# EAGLE schematic MystiqueJamma (EAGLE 9.1.3)
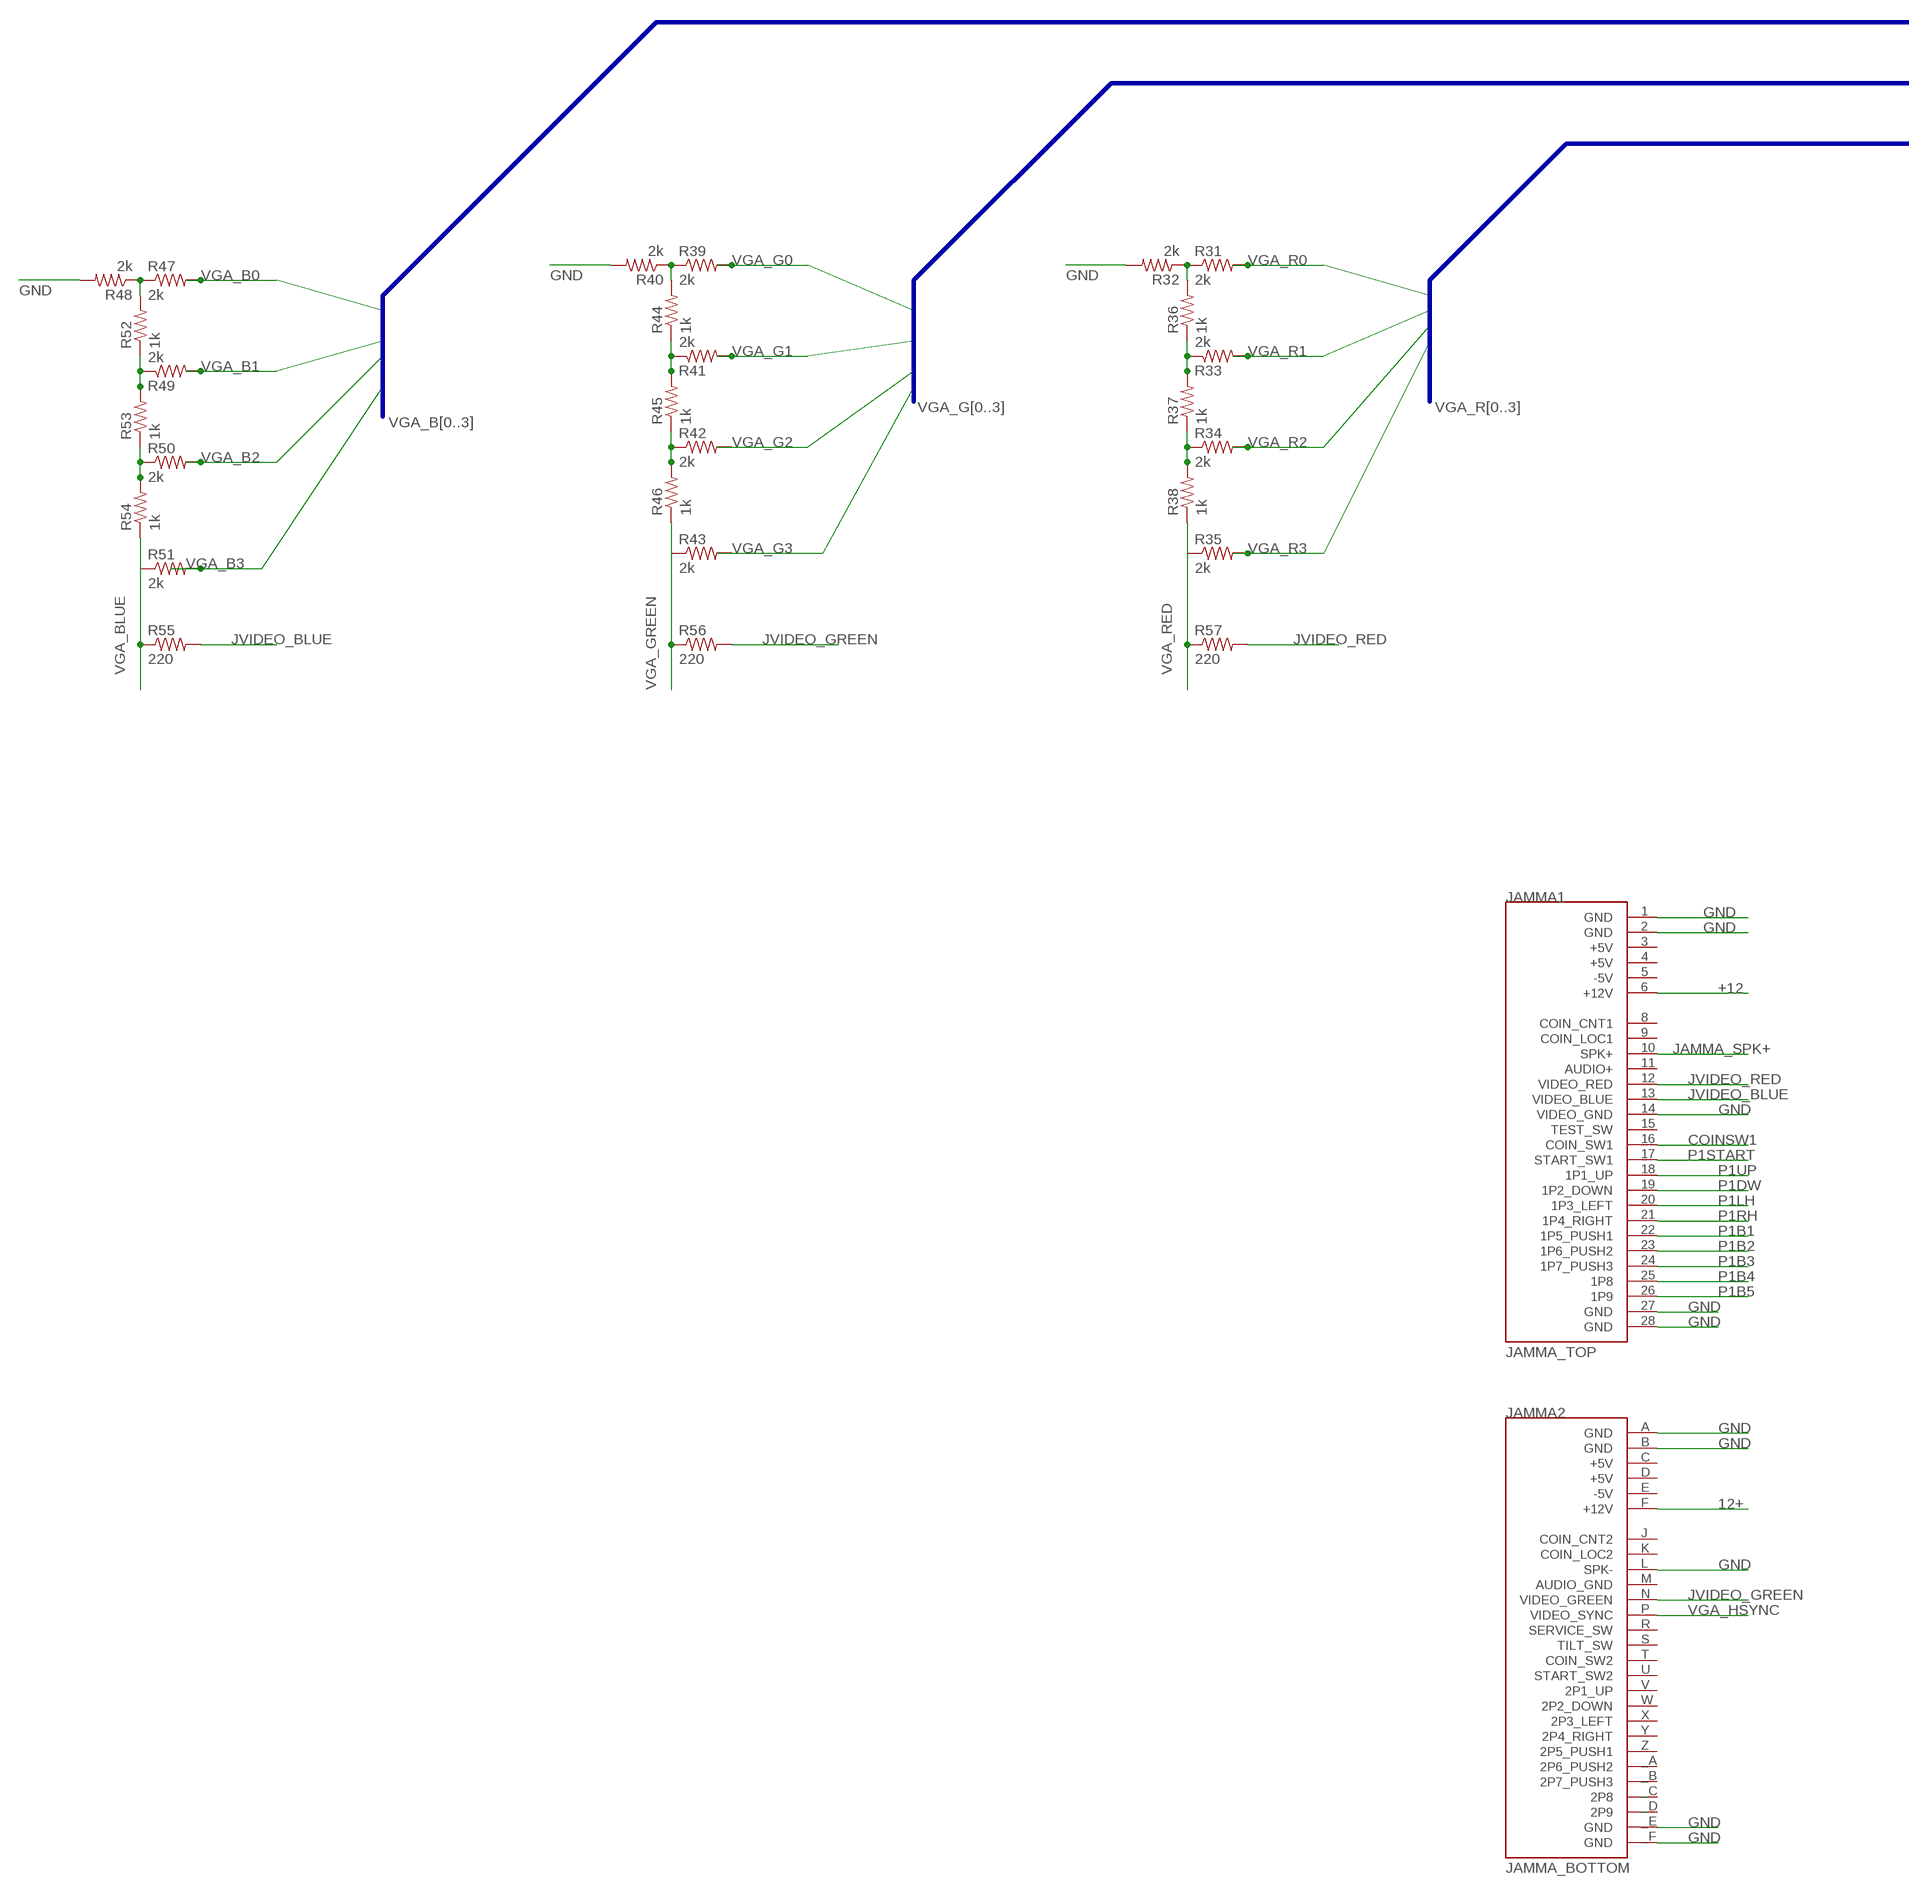
[diagram p0: schematic, sheet 1, part 1 of 2]
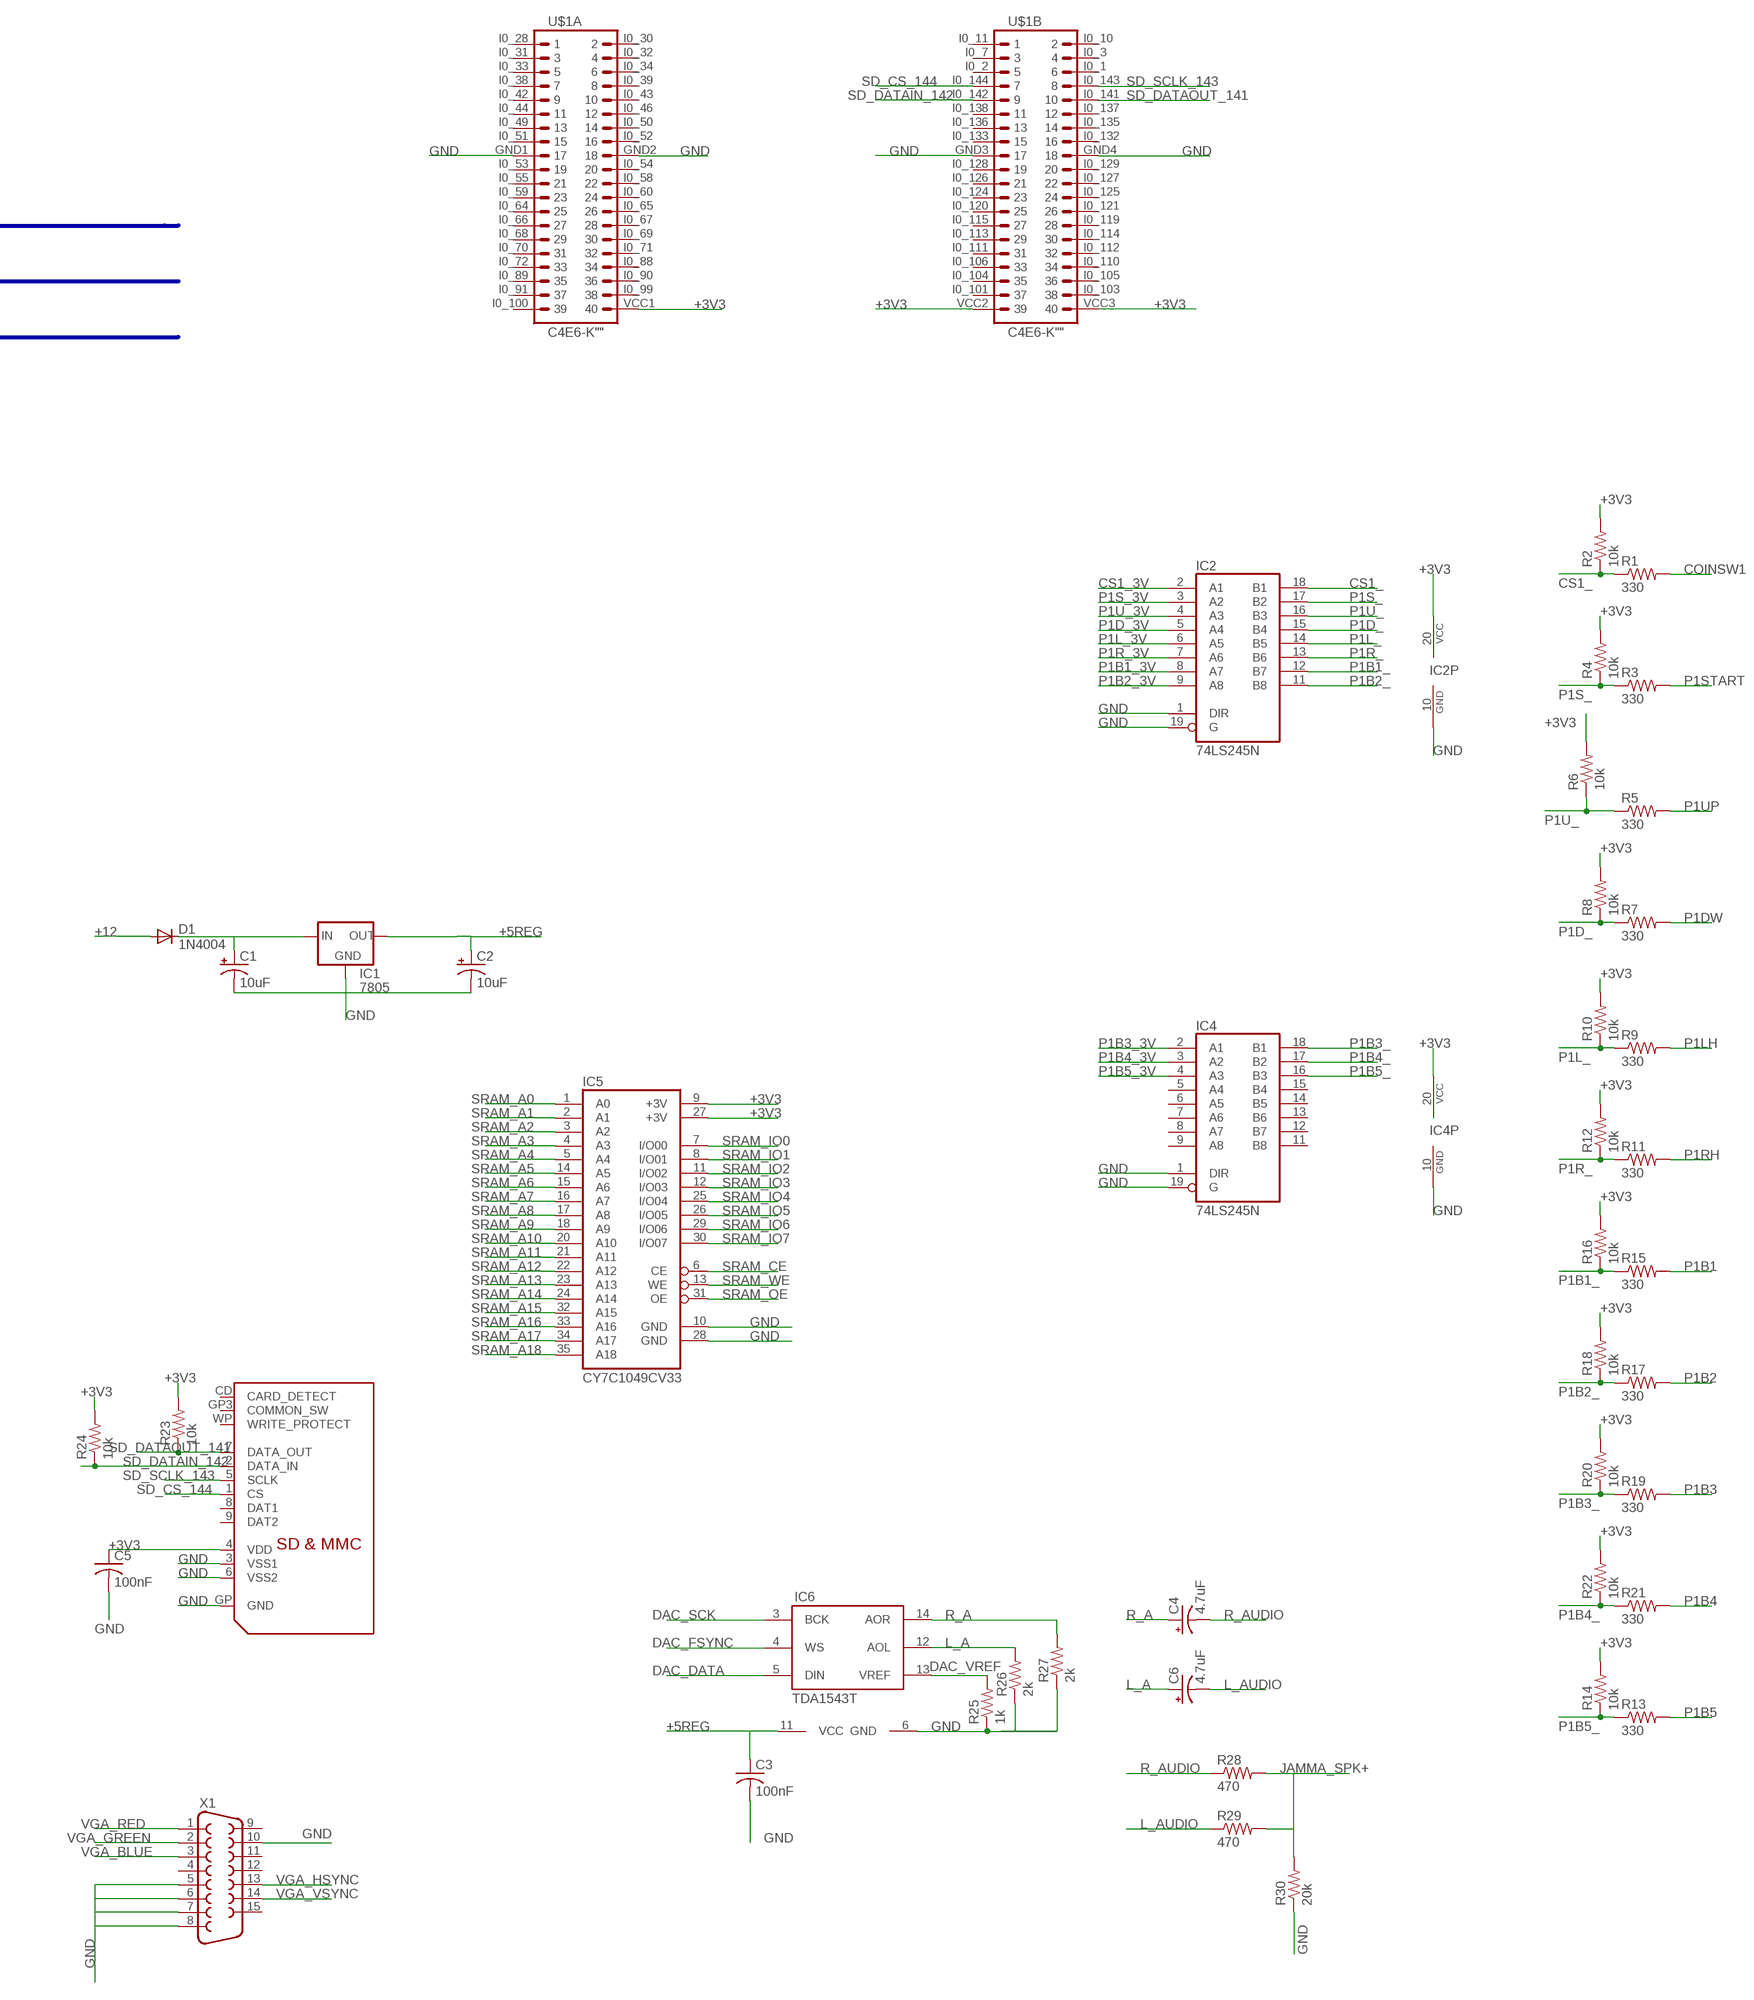
[diagram p1: schematic, sheet 1, part 2 of 2]

## Parts
C1  10uF  CPOL-USE2.5-5  [E2,5-5]
C2  10uF  CPOL-USE2.5-5  [E2,5-5]
C3  100nF  C-US025-025X050  [C025-025X050]
C4  4.7uF  CPOL-USE5-6  [E5-6]
C5  100nF  C-US025-024X044  [C025-024X044]
C6  4.7uF  CPOL-USE5-6  [E5-6]
D1  1N4004  [DO41-10]
IC1  7805  V_REG_78XXSINK  [TO220-IGO]
IC2  74LS245N  [DIL20]
IC4  74LS245N  [DIL20]
IC5  CY7C1049CV33  [SOJV36-400]
IC6  TDA1543T  [SOIC-16NW]
JAMMA1  JAMMA_TOP  [JAMMA_TOP]
JAMMA2  JAMMA_BOTTOM  [JAMMA_BOTTOM]
R1  330  R-US_0207/7  [0207/7]
R2  10k  R-US_0207/7  [0207/7]
R3  330  R-US_0207/7  [0207/7]
R4  10k  R-US_0207/7  [0207/7]
R5  330  R-US_0207/7  [0207/7]
R6  10k  R-US_0207/7  [0207/7]
R7  330  R-US_0207/7  [0207/7]
R8  10k  R-US_0207/7  [0207/7]
R9  330  R-US_0207/7  [0207/7]
R10  10k  R-US_0207/7  [0207/7]
R11  330  R-US_0207/7  [0207/7]
R12  10k  R-US_0207/7  [0207/7]
R13  330  R-US_0207/7  [0207/7]
R14  10k  R-US_0207/7  [0207/7]
R15  330  R-US_0207/7  [0207/7]
R16  10k  R-US_0207/7  [0207/7]
R17  330  R-US_0207/7  [0207/7]
R18  10k  R-US_0207/7  [0207/7]
R19  330  R-US_0207/7  [0207/7]
R20  10k  R-US_0207/7  [0207/7]
R21  330  R-US_0207/7  [0207/7]
R22  10k  R-US_0207/7  [0207/7]
R23  10k  R-US_0207/7  [0207/7]
R24  10k  R-US_0207/7  [0207/7]
R25  1k  R-US_0207/7  [0207/7]
R26  2k  R-US_0207/7  [0207/7]
R27  2k  R-US_0207/7  [0207/7]
R28  470  R-US_0207/7  [0207/7]
R29  470  R-US_0207/7  [0207/7]
R30  20k  R-US_0207/7  [0207/7]
R31  2k  R-US_0207/7  [0207/7]
R32  2k  R-US_0207/7  [0207/7]
R33  2k  R-US_0207/7  [0207/7]
R34  2k  R-US_0207/7  [0207/7]
R35  2k  R-US_0207/7  [0207/7]
R36  1k  R-US_0207/7  [0207/7]
R37  1k  R-US_0207/7  [0207/7]
R38  1k  R-US_0207/7  [0207/7]
R39  2k  R-US_0207/7  [0207/7]
R40  2k  R-US_0207/7  [0207/7]
R41  2k  R-US_0207/7  [0207/7]
R42  2k  R-US_0207/7  [0207/7]
R43  2k  R-US_0207/7  [0207/7]
R44  1k  R-US_0207/7  [0207/7]
R45  1k  R-US_0207/7  [0207/7]
R46  1k  R-US_0207/7  [0207/7]
R47  2k  R-US_0207/7  [0207/7]
R48  2k  R-US_0207/7  [0207/7]
R49  2k  R-US_0207/7  [0207/7]
R50  2k  R-US_0207/7  [0207/7]
R51  2k  R-US_0207/7  [0207/7]
R52  1k  R-US_0207/7  [0207/7]
R53  1k  R-US_0207/7  [0207/7]
R54  1k  R-US_0207/7  [0207/7]
R55  220  R-US_0207/7  [0207/7]
R56  220  R-US_0207/7  [0207/7]
R57  220  R-US_0207/7  [0207/7]
U$1  C4E6-K""  [E6V33]
U$2  SDMMC06132  [06132]
X1  F15HDH  [HDF15H]

## Nets
12+: JAMMA2.F(+12V)
+3V3: C5.1 IC2.20(VCC) IC4.20(VCC) IC5.9(+3V) IC5.27(+3V) R2.2 R4.2 R6.2 R8.2 R10.2 R12.2 R14.2 R16.2 R18.2 R20.2 R22.2 R23.2 R24.2 U$1.VCC1 U$1.VCC2 U$2.4(VDD)
+5REG: C2.+ C3.1 IC1.OUT IC6.11(VCC)
+12: D1.A JAMMA1.6(+12V)
COINSW1: JAMMA1.16(COIN_SW1) R1.2
CS1_: IC2.18(B1) R1.1 R2.1
CS1_3V: IC2.2(A1)
DAC_DATA: IC6.5(DIN)
DAC_FSYNC: IC6.4(WS)
DAC_SCK: IC6.3(BCK)
DAC_VREF: IC6.13(VREF) R25.2
GND: C1.- C2.- C3.2 C5.2 IC1.GND IC2.1(DIR) IC2.10(GND) IC2.19(G) IC4.1(DIR) IC4.10(GND) IC4.19(G) IC5.10(GND) IC5.28(GND) IC6.6(GND) JAMMA1.1(GND) JAMMA1.2(GND) JAMMA1.14(VIDEO_GND) JAMMA1.27(GND) JAMMA1.28(GND) JAMMA2._E(GND) JAMMA2._F(GND) JAMMA2.A(GND) JAMMA2.B(GND) JAMMA2.L(SPK-) R25.1 R26.1 R27.1 R30.1 R32.2 R40.2 R48.2 U$1.GND1 U$1.GND2 U$1.GND3 U$1.GND4 U$2.3(VSS1) U$2.6(VSS2) U$2.GP(GND) X1.5 X1.10
JAMMA_SPK+: JAMMA1.10(SPK+) R28.2 R29.2 R30.2
JVIDEO_BLUE: JAMMA1.13(VIDEO_BLUE) R55.2
JVIDEO_GREEN: JAMMA2.N(VIDEO_GREEN) R56.2
JVIDEO_RED: JAMMA1.12(VIDEO_RED) R57.2
L_A: C6.+ IC6.12(AOL) R26.2
L_AUDIO: C6.- R29.1
N$1: R31.1 R32.1 R36.2
N$2: C1.+ D1.C IC1.IN
N$3: R33.1 R36.1 R37.2
N$4: X1.8
N$5: X1.7
N$6: X1.6
N$7: R34.1 R37.1 R38.2
N$8: R39.1 R40.1 R44.2
N$9: R41.1 R44.1 R45.2
N$10: R42.1 R45.1 R46.2
N$11: R47.1 R48.1 R52.2
N$12: R49.1 R52.1 R53.2
N$13: R50.1 R53.1 R54.2
P1B1: JAMMA1.22(1P5_PUSH1) R15.2
P1B1_: IC2.12(B7) R15.1 R16.1
P1B1_3V: IC2.8(A7)
P1B2: JAMMA1.23(1P6_PUSH2) R17.2
P1B2_: IC2.11(B8) R17.1 R18.1
P1B2_3V: IC2.9(A8)
P1B3: JAMMA1.24(1P7_PUSH3) R19.2
P1B3_: IC4.18(B1) R19.1 R20.1
P1B3_3V: IC4.2(A1)
P1B4: JAMMA1.25(1P8) R21.2
P1B4_: IC4.17(B2) R21.1 R22.1
P1B4_3V: IC4.3(A2)
P1B5: JAMMA1.26(1P9) R13.2
P1B5_: IC4.16(B3) R13.1 R14.1
P1B5_3V: IC4.4(A3)
P1D_: IC2.15(B4) R7.1 R8.1
P1D_3V: IC2.5(A4)
P1DW: JAMMA1.19(1P2_DOWN) R7.2
P1L_: IC2.14(B5) R9.1 R10.1
P1L_3V: IC2.6(A5)
P1LH: JAMMA1.20(1P3_LEFT) R9.2
P1R_: IC2.13(B6) R11.1 R12.1
P1R_3V: IC2.7(A6)
P1RH: JAMMA1.21(1P4_RIGHT) R11.2
P1S_: IC2.17(B2) R3.1 R4.1
P1S_3V: IC2.3(A2)
P1START: JAMMA1.17(START_SW1) R3.2
P1U_: IC2.16(B3) R5.1 R6.1
P1U_3V: IC2.4(A3)
P1UP: JAMMA1.18(1P1_UP) R5.2
R_A: C4.+ IC6.14(AOR) R27.2
R_AUDIO: C4.- R28.1
SD_CS_144: U$1.I0_144 U$2.1(CS)
SD_DATAIN_142: R24.1 U$1.I0_142 U$2.2(DATA_IN)
SD_DATAOUT_141: R23.1 U$1.I0_141 U$2.7(DATA_OUT)
SD_SCLK_143: U$1.I0_143 U$2.5(SCLK)
SRAM_A0: IC5.1(A0)
SRAM_A1: IC5.2(A1)
SRAM_A2: IC5.3(A2)
SRAM_A3: IC5.4(A3)
SRAM_A4: IC5.5(A4)
SRAM_A5: IC5.14(A5)
SRAM_A6: IC5.15(A6)
SRAM_A7: IC5.16(A7)
SRAM_A8: IC5.17(A8)
SRAM_A9: IC5.18(A9)
SRAM_A10: IC5.20(A10)
SRAM_A11: IC5.21(A11)
SRAM_A12: IC5.22(A12)
SRAM_A13: IC5.23(A13)
SRAM_A14: IC5.24(A14)
SRAM_A15: IC5.32(A15)
SRAM_A16: IC5.33(A16)
SRAM_A17: IC5.34(A17)
SRAM_A18: IC5.35(A18)
SRAM_CE: IC5.6(CE)
SRAM_IO0: IC5.7(I/O00)
SRAM_IO1: IC5.8(I/O01)
SRAM_IO2: IC5.11(I/O02)
SRAM_IO3: IC5.12(I/O03)
SRAM_IO4: IC5.25(I/O04)
SRAM_IO5: IC5.26(I/O05)
SRAM_IO6: IC5.29(I/O06)
SRAM_IO7: IC5.30(I/O07)
SRAM_OE: IC5.31(OE)
SRAM_WE: IC5.13(WE)
VGA_B0: R47.2
VGA_B1: R49.2
VGA_B2: R50.2
VGA_B3: R51.2
VGA_BLUE: R51.1 R54.1 R55.1 X1.3
VGA_G0: R39.2
VGA_G1: R41.2
VGA_G2: R42.2
VGA_G3: R43.2
VGA_GREEN: R43.1 R46.1 R56.1 X1.2
VGA_HSYNC: JAMMA2.P(VIDEO_SYNC) X1.13
VGA_R0: R31.2
VGA_R1: R33.2
VGA_R2: R34.2
VGA_R3: R35.2
VGA_RED: R35.1 R38.1 R57.1 X1.1
VGA_VSYNC: X1.14
Unconnected: IC4.5(A4) IC4.6(A5) IC4.7(A6) IC4.8(A7) IC4.9(A8) IC4.11(B8) IC4.12(B7) IC4.13(B6) IC4.14(B5) IC4.15(B4) JAMMA1.8(COIN_CNT1) JAMMA1.9(COIN_LOC1) JAMMA1.11(AUDIO+) JAMMA1.15(TEST_SW) JAMMA2._A(2P6_PUSH2) JAMMA2._B(2P7_PUSH3) JAMMA2._C(2P8) JAMMA2._D(2P9) JAMMA2.J(COIN_CNT2) JAMMA2.K(COIN_LOC2) JAMMA2.M(AUDIO_GND) JAMMA2.R(SERVICE_SW) JAMMA2.S(TILT_SW) JAMMA2.T(COIN_SW2) JAMMA2.U(START_SW2) JAMMA2.V(2P1_UP) JAMMA2.W(2P2_DOWN) JAMMA2.X(2P3_LEFT) JAMMA2.Y(2P4_RIGHT) JAMMA2.Z(2P5_PUSH1) U$1.I0_1 U$1.I0_2 U$1.I0_3 U$1.I0_7 U$1.I0_10 U$1.I0_11 U$1.I0_28 U$1.I0_30 U$1.I0_31 U$1.I0_32 U$1.I0_33 U$1.I0_34 U$1.I0_38 U$1.I0_39 U$1.I0_42 U$1.I0_43 U$1.I0_44 U$1.I0_46 U$1.I0_49 U$1.I0_50 U$1.I0_51 U$1.I0_52 U$1.I0_53 U$1.I0_54 U$1.I0_55 U$1.I0_58 U$1.I0_59 U$1.I0_60 U$1.I0_64 U$1.I0_65 U$1.I0_66 U$1.I0_67 U$1.I0_68 U$1.I0_69 U$1.I0_70 U$1.I0_71 U$1.I0_72 U$1.I0_88 U$1.I0_89 U$1.I0_90 U$1.I0_91 U$1.I0_99 U$1.I0_100 U$1.I0_101 U$1.I0_103 U$1.I0_104 U$1.I0_105 U$1.I0_106 U$1.I0_110 U$1.I0_111 U$1.I0_112 U$1.I0_113 U$1.I0_114 U$1.I0_115 U$1.I0_119 U$1.I0_120 U$1.I0_121 U$1.I0_124 U$1.I0_125 U$1.I0_126 U$1.I0_127 U$1.I0_128 U$1.I0_129 U$1.I0_132 U$1.I0_133 U$1.I0_135 U$1.I0_136 U$1.I0_137 U$1.I0_138 U$1.VCC3 U$2.8(DAT1) U$2.9(DAT2) U$2.CD(CARD_DETECT) U$2.GP3(COMMON_SW) U$2.WP(WRITE_PROTECT) X1.4 X1.9 X1.11 X1.12 X1.15

## Buses
VGA_R[0..3]
VGA_G[0..3]
VGA_B[0..3]

## Power pins joined to a net without a drawn wire
+5V: JAMMA1.3(+5V) JAMMA1.4(+5V) JAMMA2.C(+5V) JAMMA2.D(+5V)
-5V: JAMMA1.5(-5V) JAMMA2.E(-5V)

## Library data of the parts
C1 C2 = rcl-2:CPOL-US: POLARIZED CAPACITOR, American symbol
C3 C5 = adafruit:C-US: CAPACITOR, American symbol
C4 C6 = adafruit:CPOL-US: POLARIZED CAPACITOR, American symbol
D1 = adafruit:1N4004: DIODE General purpose 1N400x type rectifier (With bigger pads) http://www.ladyada.net/library/pcb/eaglelibrary.html
IC1 = SparkFun:V_REG_78XX: Voltage Regulator Standard 7805 5V regulator. IGO (Input Ground Output). Spark Fun Electronics SKU : COM-00107
IC2 IC4 = 74xx-us:74*245: Octal BUS TRANSCEIVER, 3-state
IC5 = memory-sram:CY7C1049CV33: 4-Mbit (512K x 8) Static RAM Source: CYPRESS cy7c1049cv33_8.pdf
IC6 = TDA1543:TDA1543: TDA1543 I2S DAC
JAMMA1 = JAMMA:JAMMA_TOP: JAMMA Connector Top Parts side for these card-edge connenctors HIROSE CR7E-56DA-3.96E HIROSE CR7E-56DB-3.96E KEL 1168-056-009
JAMMA2 = JAMMA:JAMMA_BOTTOM: JAMMA Connector Bottom Solder side for these card-edge connenctors HIROSE CR7E-56DA-3.96E HIROSE CR7E-56DB-3.96E KEL 1168-056-009
R1-R57 = adafruit:R-US_: RESISTOR, American symbol
U$1 = FPGA-BOARD:C4E6-K: FPGA board size C4E6 - Cyclone IV
U$2 = adafruit:SDMMC: SD MMC Card holder 4UCON part #06132 - easy to solder
X1 = adafruit:F15: SUB-D HDH is also known as a 'right angle VGA' connector